# EAGLE schematic SharkBait (EAGLE 7.1.0)
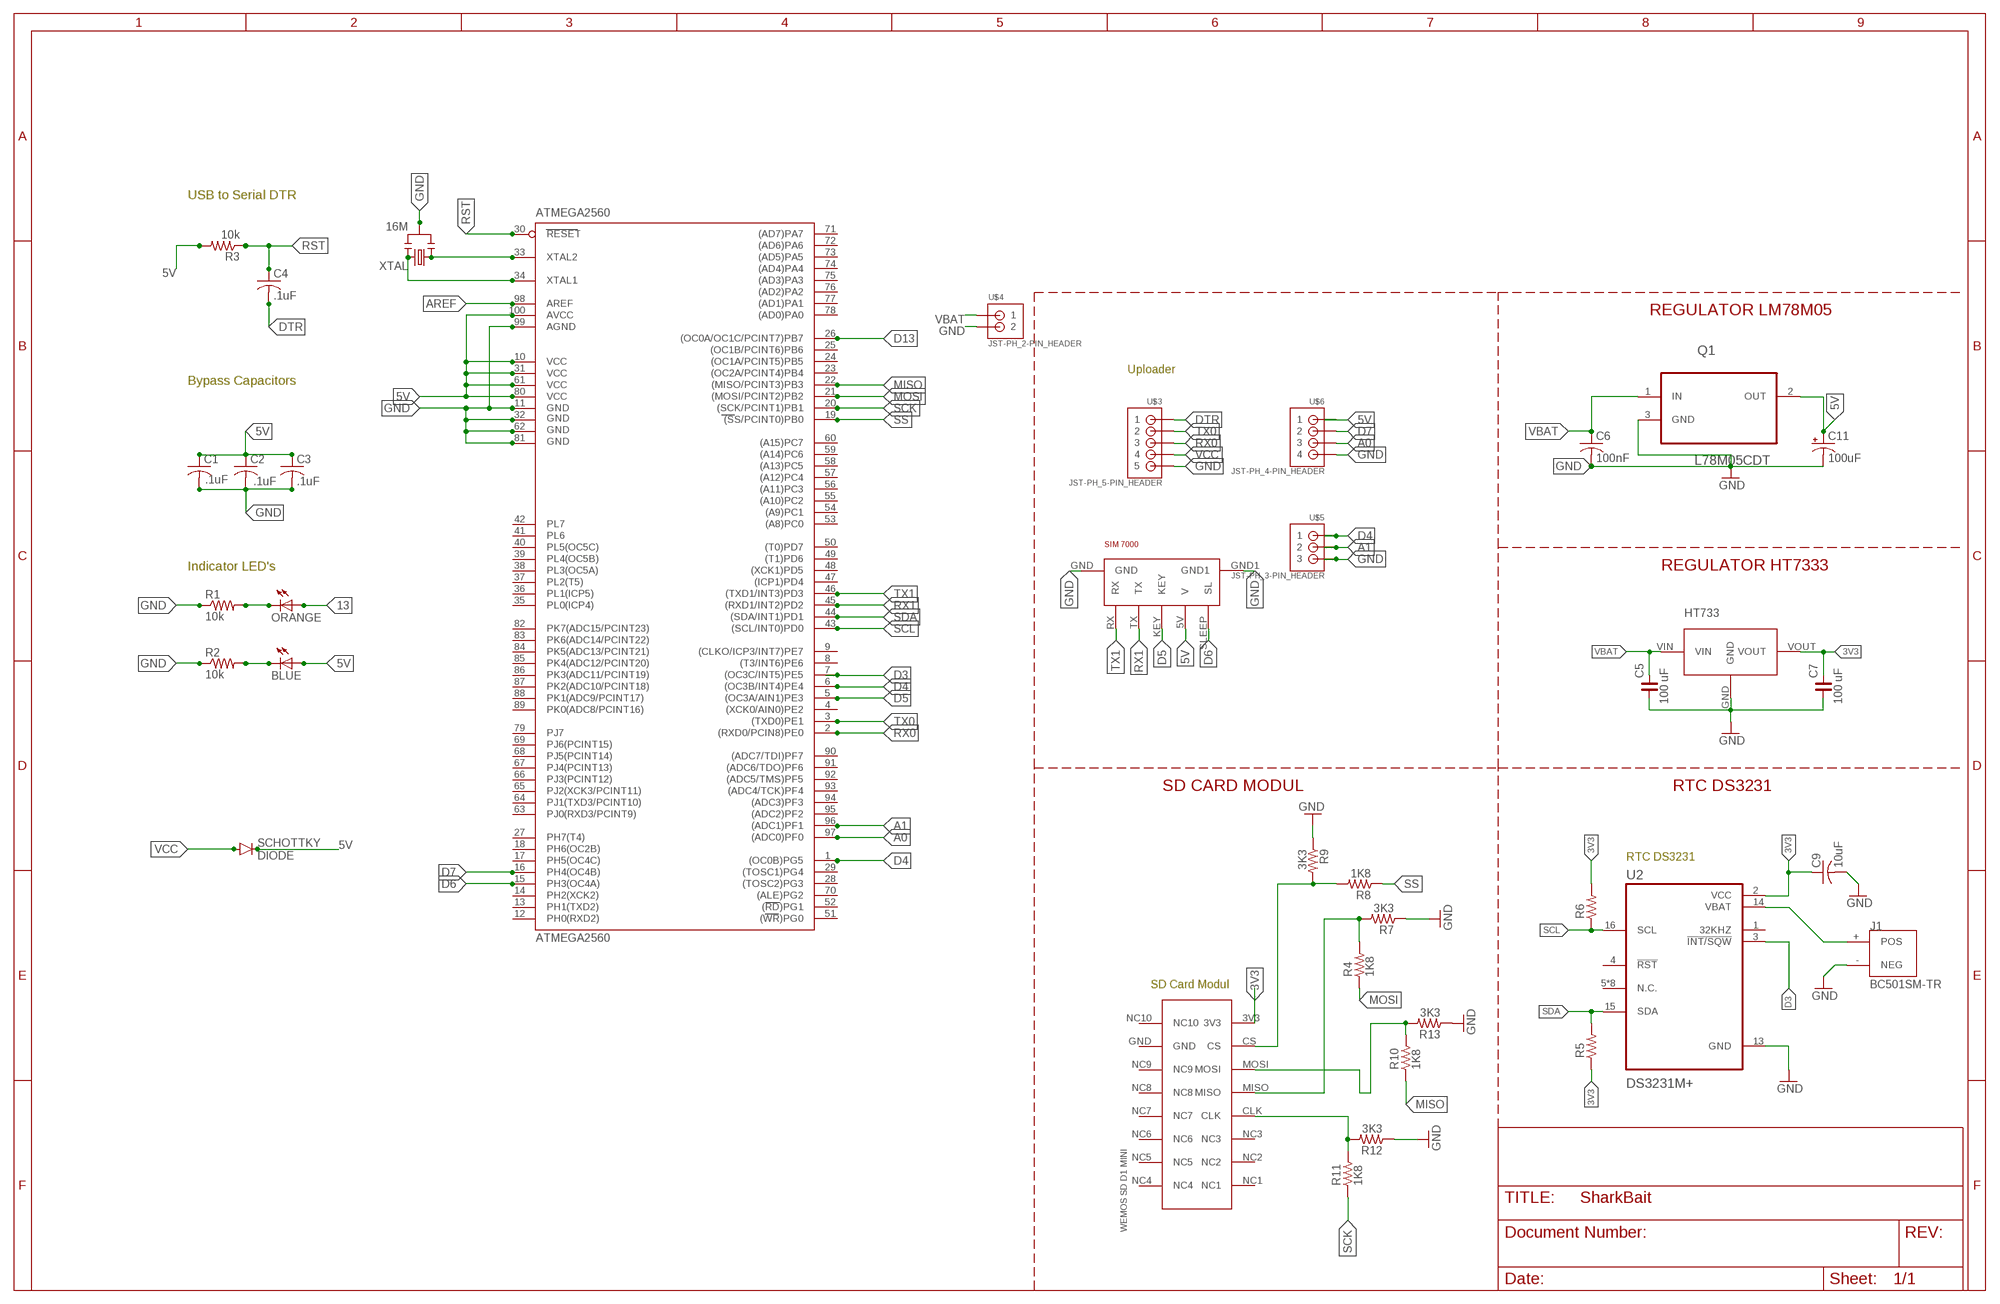
[diagram p0: schematic, sheet 1]

## Parts
ATMEGA2560  ATMEGA2560  [TQFP100]
BLUE  L  LED-SMD-0805  [SMD-0805-LED]
C1  CAPACITOR-SMD-0805  [SMD-0805]
C2  .1uF  CAPACITOR-SMD-0805  [SMD-0805]
C3  .1uF  CAPACITOR-SMD-0805  [SMD-0805]
C4  .1uF  CAPACITOR-SMD-0805  [SMD-0805]
C5  100 uF  C_0805  [C0805]
C6  100nF  C-USC1206  [C1206]
C7  100 uF  C_0805  [C0805]
C9  10uF  CAPACITOR-SMD-0805  [SMD-0805]
C11  100uF  CPOL-USD  [PANASONIC_D]
HT733  HT7333  [SOT89]
J1  BC501SM-TR  [MPD_BC501SM-TR]
ORANGE  L  LED-SMD-0805  [SMD-0805-LED]
Q1  L78M05CDT  [TO225P972X240-3N]
R1  10k  RESISTOR-SMD-0805  [SMD-0805]
R2  10k  RESISTOR-SMD-0805  [SMD-0805]
R3  10k  RESISTOR-SMD-0805  [SMD-0805]
R4  1K8  R_0805  [R0805]
R5  R_0805  [R0805]
R6  R_0805  [R0805]
R7  3K3  R_0805  [R0805]
R8  1K8  R_0805  [R0805]
R9  3K3  R_0805  [R0805]
R10  1K8  R_0805  [R0805]
R11  1K8  R_0805  [R0805]
R12  3K3  R_0805  [R0805]
R13  3K3  R_0805  [R0805]
SCHOTTKY  DIODE  [SOD-323]
U2  DS3231M+  [SOIC127P1032X265-16N]
U$1  WEMOS_SD_D1_MINI  [WEMOS_SD_D1_MINI]
U$2  SIM7000  [SIM_7000]
U$3  JST-PH_5-PIN_HEADER  [JST_B5B-PH_HEADER]
U$4  JST-PH_2-PIN_HEADER  [JST_B2B-PH_HEADER]
U$5  JST-PH_3-PIN_HEADER  [JST_B3B-PH_HEADER]
U$6  JST-PH_4-PIN_HEADER  [JST_B4B-PH_HEADER]
XTAL  16M  RESONATOR  [RESONATOR]

## Nets
3V3: C7.2 C9.1 HT733.VOUT R5.1 R6.2 U2.2(VCC) U$1.3V3
5V: ATMEGA2560.10(VCC) ATMEGA2560.31(VCC1) ATMEGA2560.61(VCC2) ATMEGA2560.80(VCC3) ATMEGA2560.100(AVCC) BLUE.1(A) C1.1 C2.1 C3.1 C11.+ Q1.2(OUT) R3.2 SCHOTTKY.C U$2.5V(V) U$6.P1
13: ORANGE.1(A)
A0: ATMEGA2560.97((ADC0)PF0) U$6.P3
A1: ATMEGA2560.96((ADC1)PF1) U$5.P2
AREF: ATMEGA2560.98(AREF)
D3: ATMEGA2560.7((OC3C/INT5)PE5) U2.3(!INT/SQW)
D4: ATMEGA2560.1((OC0B)PG5) ATMEGA2560.6((OC3B/INT4)PE4) U$5.P1
D5: ATMEGA2560.5((OC3A/AIN1)PE3) U$2.KEY
D6: ATMEGA2560.15(PH3(OC4A)) U$2.SLEEP(SL)
D7: ATMEGA2560.16(PH4(OC4B)) U$6.P2
D13: ATMEGA2560.26((OC0A/OC1C/PCINT7)PB7)
DTR: C4.2 U$3.P1
GND: ATMEGA2560.11(GND) ATMEGA2560.32(GND1) ATMEGA2560.62(GND2) ATMEGA2560.81(GND3) ATMEGA2560.99(AGND) C1.2 C2.2 C3.2 C5.1 C6.2 C7.1 C9.2 C11.- HT733.GND J1.-(NEG) Q1.3(GND) R1.1 R2.1 R7.1 R9.1 R12.1 R13.1 U2.13(GND) U$2.GND U$2.GND1 U$3.P5 U$4.P2 U$5.P3 U$6.P4 XTAL.2
MISO: ATMEGA2560.22((MISO/PCINT3)PB3) R10.1 R10.2 R13.2 U$1.MOSI
MOSI: ATMEGA2560.21((MOSI/PCINT2)PB2) R4.1
N$1: J1.+(POS) U2.14(VBAT)
N$2: R4.2 R7.2 U$1.MISO
N$13: ATMEGA2560.34(XTAL1) XTAL.3
N$81: ATMEGA2560.33(XTAL2) XTAL.1
N$82: ORANGE.2(C) R1.2
N$83: BLUE.2(C) R2.2
RST: ATMEGA2560.30(RESET) C4.1 R3.1
RX0: ATMEGA2560.2((RXD0/PCIN8)PE0) U$3.P3
RX1: ATMEGA2560.45((RXD1/INT2)PD2) U$2.TX
SCK: ATMEGA2560.20((SCK/PCINT1)PB1) R11.1 R11.2 R12.2 U$1.CLK
SCK1: R8.2 R9.2 U$1.CS
SCL: ATMEGA2560.43((SCL/INT0)PD0) R6.1 U2.16(SCL)
SDA: ATMEGA2560.44((SDA/INT1)PD1) R5.2 U2.15(SDA)
SS: ATMEGA2560.19((SS/PCINT0)PB0) R8.1
TX0: ATMEGA2560.3((TXD0)PE1) U$3.P2
TX1: ATMEGA2560.46((TXD1/INT3)PD3) U$2.RX
VBAT: C5.2 C6.1 HT733.VIN Q1.1(IN) U$4.P1
VCC: SCHOTTKY.A U$3.P4
Unconnected: ATMEGA2560.4((XCK0/AIN0)PE2) ATMEGA2560.8((T3/INT6)PE6) ATMEGA2560.9((CLKO/ICP3/INT7)PE7) ATMEGA2560.12(PH0(RXD2)) ATMEGA2560.13(PH1(TXD2)) ATMEGA2560.14(PH2(XCK2)) ATMEGA2560.17(PH5(OC4C)) ATMEGA2560.18(PH6(OC2B)) ATMEGA2560.23((OC2A/PCINT4)PB4) ATMEGA2560.24((OC1A/PCINT5)PB5) ATMEGA2560.25((OC1B/PCINT6)PB6) ATMEGA2560.27(PH7(T4)) ATMEGA2560.28((TOSC2)PG3) ATMEGA2560.29((TOSC1)PG4) ATMEGA2560.35(PL0(ICP4)) ATMEGA2560.36(PL1(ICP5)) ATMEGA2560.37(PL2(T5)) ATMEGA2560.38(PL3(OC5A)) ATMEGA2560.39(PL4(OC5B)) ATMEGA2560.40(PL5(OC5C)) ATMEGA2560.41(PL6) ATMEGA2560.42(PL7) ATMEGA2560.47((ICP1)PD4) ATMEGA2560.48((XCK1)PD5) ATMEGA2560.49((T1)PD6) ATMEGA2560.50((T0)PD7) ATMEGA2560.51((WR)PG0) ATMEGA2560.52((RD)PG1) ATMEGA2560.53((A8)PC0) ATMEGA2560.54((A9)PC1) ATMEGA2560.55((A10)PC2) ATMEGA2560.56((A11)PC3) ATMEGA2560.57((A12)PC4) ATMEGA2560.58((A13)PC5) ATMEGA2560.59((A14)PC6) ATMEGA2560.60((A15)PC7) ATMEGA2560.63(PJ0(RXD3/PCINT9)) ATMEGA2560.64(PJ1(TXD3/PCINT10)) ATMEGA2560.65(PJ2(XCK3/PCINT11)) ATMEGA2560.66(PJ3(PCINT12)) ATMEGA2560.67(PJ4(PCINT13)) ATMEGA2560.68(PJ5(PCINT14)) ATMEGA2560.69(PJ6(PCINT15)) ATMEGA2560.70((ALE)PG2) ATMEGA2560.71((AD7)PA7) ATMEGA2560.72((AD6)PA6) ATMEGA2560.73((AD5)PA5) ATMEGA2560.74((AD4)PA4) ATMEGA2560.75((AD3)PA3) ATMEGA2560.76((AD2)PA2) ATMEGA2560.77((AD1)PA1) ATMEGA2560.78((AD0)PA0) ATMEGA2560.79(PJ7) ATMEGA2560.82(PK7(ADC15/PCINT23)) ATMEGA2560.83(PK6(ADC14/PCINT22)) ATMEGA2560.84(PK5(ADC13/PCINT21)) ATMEGA2560.85(PK4(ADC12/PCINT20)) ATMEGA2560.86(PK3(ADC11/PCINT19)) ATMEGA2560.87(PK2(ADC10/PCINT18)) ATMEGA2560.88(PK1(ADC9/PCINT17)) ATMEGA2560.89(PK0(ADC8/PCINT16)) ATMEGA2560.90((ADC7/TDI)PF7) ATMEGA2560.91((ADC6/TDO)PF6) ATMEGA2560.92((ADC5/TMS)PF5) ATMEGA2560.93((ADC4/TCK)PF4) ATMEGA2560.94((ADC3)PF3) ATMEGA2560.95((ADC2)PF2) U2.1(32KHZ) U2.4(!RST) U2.5(N.C.) U2.6(N.C.) U2.7(N.C.) U2.8(N.C.) U2.9(N.C.) U2.10(N.C.) U2.11(N.C.) U2.12(N.C.) U$1.GND U$1.NC1 U$1.NC2 U$1.NC3 U$1.NC4 U$1.NC5 U$1.NC6 U$1.NC7 U$1.NC8 U$1.NC9 U$1.NC10

## Notes on the sheet
- USB to Serial DTR
- REGULATOR LM78M05
- Uploader
- Bypass Capacitors
- .1uF
- Indicator LED's | REGULATOR HT7333
- SD CARD MODUL | RTC DS3231
- RTC DS3231
- SD Card Modul

## Library data of the parts
ATMEGA2560 = Fuzzy:ATMEGA2560
BLUE ORANGE = Fuzzy:LED-SMD-0805
C1-C4 C9 = Fuzzy:CAPACITOR-SMD-0805
C5 C7 = rc-master-smd:C_: NON-POLARIZED CAP
C6 = rcl:C-US: CAPACITOR, American symbol
C11 = rcl:CPOL-US: POLARIZED CAPACITOR, American symbol
HT733 = C_HT7333_SOT89:HT7333
J1 = C_BC501SM-TR:BC501SM-TR: Holder Coin Cell For Cr1220 Smd; AVAILABILITY: Unavailable; DESCRIPTION: Holder Coin Cell For Cr1220 Smd; MF: MPD _Memory; MP: BC501SM-TR; PACKAGE: DFN-8 MPD; PRICE: None
Q1 = C_L78M05CDT:L78M05CDT: Positive voltage regulators; AVAILABILITY: Unavailable; DESCRIPTION: L78M Series 500 mA 5 V Three Terminal Positive Voltage LDO Regulator - TO-252; MF: STMicroelectronics; MP: L78M05CDT-TR; PACKAGE: TO-252-3 STMicroelectronics; PRICE: None
R1-R3 = Fuzzy:RESISTOR-SMD-0805
R4-R13 = rc-master-smd:R_: RESISTOR
SCHOTTKY = Fuzzy:DIODE
U2 = C_DS3231M_:DS3231M+; DESCRIPTION: Ic Real Time Clock I2c 16soic - Ds3231m+; DIGI-KEY_PART_NUMBER: DS3231M+-ND; DIGI-KEY_PURCHASE_URL: https://www.digikey.co.id/product-detail/en/maxim-integrated/DS3231M-/DS3231M--ND/2402420?utm_source=snapeda&utm_medium=aggregator&utm_campaign=symbol; MF: Maxim Integrated; MP: DS3231M+; PACKAGE: SOIC-16 Maxim
U$1 = C_WEMOS_SD_D1_MINI:WEMOS_SD_D1_MINI
U$2 = C_SIM7000:SIM7000
U$3 = srg:JST-PH_5-PIN_HEADER: 5-pin JST PH Shrouded Header, top entry P/N B5B-PH-K-S Mating connector PHR-5 Mating cable assembly: Sparkfun PRT-09917 <http://www.sparkfun.com/products/9917>
U$4 = srg:JST-PH_2-PIN_HEADER: 2-pin JST PH Shrouded Header, top entry P/N B2B-PH-K-S Mating connector PHR-2 Mating cable assembly: Sparkfun PRT-09914 <http://www.sparkfun.com/products/9914>
U$5 = srg:JST-PH_3-PIN_HEADER: 3-pin JST PH Shrouded Header, top entry P/N B3B-PH-K-S Mating connector PHR-3
U$6 = srg:JST-PH_4-PIN_HEADER: 4-pin JST PH Shrouded Header, top entry P/N B4B-PH-K-S Mating connector PHR-4 Mating cable assembly: Sparkfun PRT-09916 <http://www.sparkfun.com/products/9916>
XTAL = Fuzzy:RESONATOR